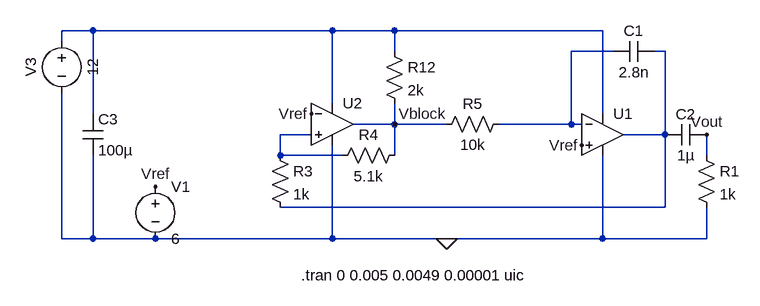
[diagram p0: schematic Triangular_signal_generator_simulation.asc]
Triangular_signal_generator_simulation.asc, the LTspice schematic file:
Version 4
SHEET 1 1568 708
WIRE -736 288 -784 288
WIRE -368 288 -736 288
WIRE -272 288 -368 288
WIRE 48 288 -272 288
WIRE -784 304 -784 288
WIRE -272 320 -272 288
WIRE 64 320 0 320
WIRE 144 320 128 320
WIRE -368 400 -368 288
WIRE -736 416 -736 288
WIRE 48 416 48 288
WIRE -272 432 -272 400
WIRE -272 432 -336 432
WIRE -192 432 -272 432
WIRE 0 432 0 320
WIRE 0 432 -112 432
WIRE 16 432 0 432
WIRE -400 448 -448 448
WIRE 144 448 144 320
WIRE 144 448 80 448
WIRE -448 480 -448 448
WIRE -352 480 -448 480
WIRE -272 480 -272 432
WIRE 208 480 208 448
WIRE 144 560 144 448
WIRE 144 560 -448 560
WIRE -784 608 -784 384
WIRE -736 608 -736 480
WIRE -736 608 -784 608
WIRE -640 608 -736 608
WIRE -368 608 -368 464
WIRE -368 608 -640 608
WIRE -192 608 -368 608
WIRE 48 608 48 480
WIRE 48 608 -192 608
WIRE 208 608 208 560
WIRE 208 608 48 608
FLAG -192 608 0
FLAG -272 432 Vblock
FLAG -640 528 Vref
FLAG -400 416 Vref
FLAG 16 464 Vref
FLAG 208 448 Vout
SYMBOL res -464 464 R0
SYMATTR InstName R3
SYMATTR Value 1k
SYMBOL res -256 464 R90
WINDOW 0 0 56 VBottom 2
WINDOW 3 32 56 VTop 2
SYMATTR InstName R4
SYMATTR Value 5.1k
SYMBOL res -96 416 R90
WINDOW 0 0 56 VBottom 2
WINDOW 3 32 56 VTop 2
SYMATTR InstName R5
SYMATTR Value 10k
SYMBOL cap 128 304 R90
WINDOW 0 0 32 VBottom 2
WINDOW 3 32 32 VTop 2
SYMATTR InstName C1
SYMATTR Value 2.8n
SYMBOL voltage -784 288 R0
WINDOW 0 -32 56 VBottom 2
WINDOW 3 32 56 VTop 2
WINDOW 123 0 0 Left 2
WINDOW 39 0 0 Left 2
SYMATTR InstName V3
SYMATTR Value 12
SYMBOL res -288 304 R0
SYMATTR InstName R12
SYMATTR Value 2k
SYMBOL cap 208 432 R90
WINDOW 0 0 32 VBottom 2
WINDOW 3 32 32 VTop 2
SYMATTR InstName C2
SYMATTR Value 1µ
SYMBOL res 192 464 R0
SYMATTR InstName R1
SYMATTR Value 1k
SYMBOL cap -752 416 R0
SYMATTR InstName C3
SYMATTR Value 100µ
SYMBOL voltage -640 512 R0
SYMATTR InstName V1
SYMATTR Value 6
SYMBOL Opamps\\UniversalOpamp2 48 448 R0
SYMATTR InstName U1
SYMATTR Value2 Avol=10Meg GBW=100Meg Slew=100Meg
SYMATTR SpiceLine ilimit=250m rail=0 Vos=0 phimargin=45
SYMBOL Opamps\\UniversalOpamp2 -368 432 R0
SYMATTR InstName U2
SYMATTR Value2 Avol=10Meg GBW=100Meg Slew=100Meg
SYMATTR SpiceLine ilimit=250m rail=0 Vos=0 phimargin=45
TEXT -416 664 Left 2 !.tran 0 0.005 0.0049 0.00001 uic

The netlist it stands for:
* Triangular_signal_generator_simulation.asc
R3 N004 N003 1k
R4 Vblock N004 5.1k
R5 N002 Vblock 10k
C1 N003 N002 2.8n
V3 N001 0 12
R12 N001 Vblock 2k
C2 Vout N003 1µ
R1 Vout 0 1k
C3 N001 0 100µ
V1 Vref 0 6
XU1 Vref N002 N001 0 N003 level.2 Avol=10Meg GBW=100Meg Slew=100Meg ilimit=250m rail=0 Vos=0 phimargin=45 en=0 enk=0 in=0 ink=0 Rin=500Meg  ; pins IN+ IN- V+ V- OUT
XU2 N004 Vref N001 0 Vblock level.2 Avol=10Meg GBW=100Meg Slew=100Meg ilimit=250m rail=0 Vos=0 phimargin=45 en=0 enk=0 in=0 ink=0 Rin=500Meg  ; pins IN+ IN- V+ V- OUT
.tran 0 0.005 0.0049 0.00001 uic
.lib UniversalOpamps2.sub
.backanno
.end